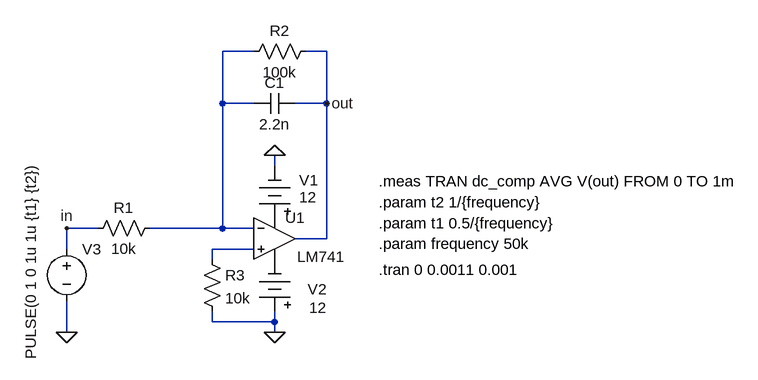
[diagram p0: schematic exp2.asc]
exp2.asc, the LTspice schematic file:
Version 4.1
SHEET 1 880 780
WIRE 112 -144 64 -144
WIRE 224 -144 192 -144
WIRE 64 -64 64 -144
WIRE 112 -64 64 -64
WIRE 224 -64 224 -144
WIRE 224 -64 176 -64
WIRE 144 32 144 16
WIRE -128 128 -176 128
WIRE 64 128 64 -64
WIRE 64 128 -48 128
WIRE 112 128 64 128
WIRE 224 144 224 -64
WIRE 224 144 176 144
WIRE -176 160 -176 128
WIRE 112 160 48 160
WIRE 48 176 48 160
WIRE 48 272 48 256
WIRE 144 272 144 256
WIRE 144 272 48 272
WIRE -176 288 -176 240
WIRE 144 288 144 272
FLAG 144 288 0
FLAG 144 16 0
FLAG -176 288 0
FLAG -176 128 in
FLAG 224 -64 out
SYMBOL OpAmps\\LM741 144 80 R0
WINDOW 3 35 92 Left 2
SYMATTR InstName U1
SYMBOL Misc\\battery 144 128 R180
WINDOW 0 -67 74 Left 2
WINDOW 3 -65 48 Left 2
WINDOW 123 0 0 Left 0
WINDOW 39 0 0 Left 0
SYMATTR InstName V1
SYMATTR Value 12
SYMBOL Misc\\battery 144 272 R180
WINDOW 0 -80 50 Left 2
WINDOW 3 -80 22 Left 2
WINDOW 123 0 0 Left 0
WINDOW 39 0 0 Left 0
SYMATTR InstName V2
SYMATTR Value 12
SYMBOL res -32 112 R90
WINDOW 0 0 56 VBottom 2
WINDOW 3 32 56 VTop 2
SYMATTR InstName R1
SYMATTR Value 10k
SYMBOL cap 176 -80 R90
WINDOW 0 0 32 VBottom 2
WINDOW 3 32 32 VTop 2
SYMATTR InstName C1
SYMATTR Value 2.2n
SYMBOL res 208 -160 R90
WINDOW 0 0 56 VBottom 2
WINDOW 3 32 56 VTop 2
SYMATTR InstName R2
SYMATTR Value 100k
SYMBOL res 32 160 R0
SYMATTR InstName R3
SYMATTR Value 10k
SYMBOL voltage -176 144 R0
WINDOW 3 -55 -117 VRight 2
WINDOW 123 0 0 Left 0
WINDOW 39 0 0 Left 0
SYMATTR InstName V3
SYMATTR Value PULSE(0 1 0 1u 1u {t1} {t2})
TEXT 304 192 Left 2 !.tran 0 0.0011 0.001
TEXT 304 152 Left 2 !.param frequency 50k
TEXT 304 120 Left 2 !.param t1 0.5/{frequency}
TEXT 304 88 Left 2 !.param t2 1/{frequency}
TEXT 304 56 Left 2 !.meas TRAN dc_comp AVG V(out) FROM 0 TO 1m

The netlist it stands for:
* exp2.asc
X§U1 N002 N001 P001 P002 out LM741  ; pins In+ In- V+ V- OUT
V1 P001 0 12
V2 0 P002 12
R1 N001 in 10k
C1 out N001 2.2n
R2 out N001 100k
R3 N002 0 10k
V3 in 0 PULSE(0 1 0 1u 1u {t1} {t2})
.tran 0 0.0011 0.001
.param frequency 50k
.param t1 0.5/{frequency}
.param t2 1/{frequency}
.meas TRAN dc_comp AVG V(out) FROM 0 TO 1m
.lib LM741.lib
.backanno
.end